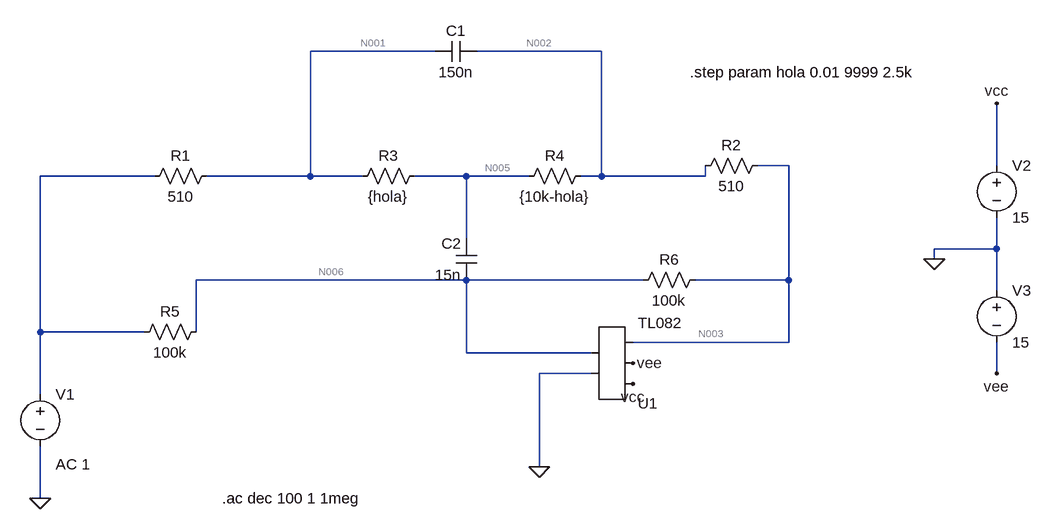
[diagram p0: schematic Spice.asc]
* Spice.asc
R1 N001 N004 510
R2 N003 N002 510
R3 N005 N001 {hola}
R4 N002 N005 {10k-hola}
R5 N006 N004 100k
R6 N003 N006 100k
C1 N002 N001 150n
C2 N006 N005 15n
V1 N004 0 AC 1
V2 vcc 0 15
V3 0 vee 15
* U1: TL082 (symbol AutoGenerated\TL082 not available, pins judged from their places): pin1=0 pin2=N006 pin3=vcc pin4=vee pin5=N003
.ac dec 100 1 1meg
.step param hola 0.01 9999 2.5k
.backanno
.end

* Results of the author's LTspice run, read from the files saved beside the schematic
* Operating Point (first step), zero values left out:
*   hola = 10 m
*   V(n001) = 1.224 µV
*   V(n003) = 26.45 µV
*   V(n002) = 25.22 µV
*   V(n005) = 1.224 µV
*   V(n006) = 10.97 µV
*   V(vcc) = 15 V
*   V(vee) = -15 V
*   I(R6) = 154.8 pA
*   I(R5) = 109.7 pA
*   I(R4) = 2.4 nA
*   I(R3) = 2.4 nA
*   I(R2) = 2.4 nA
*   I(R1) = 2.4 nA
*   I(V3) = -14.19 mA
*   I(V2) = -14.19 mA
*   I(V1) = 2.51 nA
*   Ix(u1:1) = 45.05 pA
*   Ix(u1:2) = 45.05 pA
*   Ix(u1:3) = 14.19 mA
*   Ix(u1:4) = -14.19 mA
*   Ix(u1:5) = -2.555 nA
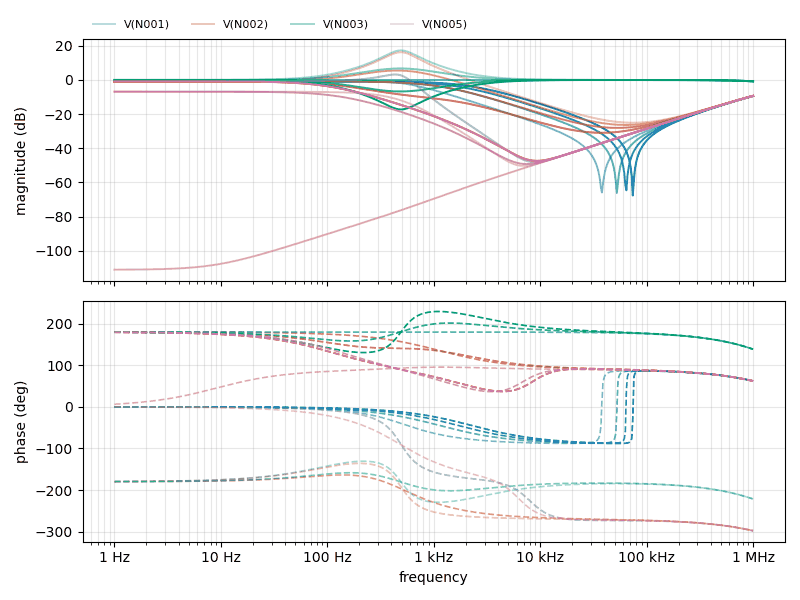
[diagram p1: AC Analysis of Spice.asc, plotted from the saved traces]
* AC Analysis, 5 runs:
*   V(N001) [hola=0.01]: -0.84 dB at 1 Hz, -9.36 dB at 1 MHz, peak 3.19 dB at 436.5 Hz, 3 dB below the peak at 190 Hz and 583 Hz
*   V(N001) [hola=2500.01]: -0.84 dB at 1 Hz, -9.37 dB at 1 MHz, peak -0.71 dB at 204.2 Hz, 3 dB below the peak at 721.6 Hz
*   V(N001) [hola=5000.01]: -0.84 dB at 1 Hz, -9.38 dB at 1 MHz, peak -0.84 dB at 1 Hz, 3 dB below the peak at 1.145 kHz
*   V(N001) [hola=7500.01]: -0.84 dB at 1 Hz, -9.39 dB at 1 MHz, peak -0.84 dB at 1 Hz, 3 dB below the peak at 1.682 kHz
*   V(N001) [hola=9999]: -0.84 dB at 1 Hz, -9.40 dB at 1 MHz, peak -0.84 dB at 1 Hz, 3 dB below the peak at 2.29 kHz
*   V(N002) [hola=0.01]: -0.84 dB at 1 Hz, -9.31 dB at 1 MHz, peak 16.25 dB at 489.8 Hz, 3 dB below the peak at 349.9 Hz and 677.6 Hz
*   V(N002) [hola=2500.01]: -0.84 dB at 1 Hz, -9.32 dB at 1 MHz, peak 5.51 dB at 457.1 Hz, 3 dB below the peak at 166.8 Hz and 1.025 kHz
*   V(N002) [hola=5000.01]: -0.84 dB at 1 Hz, -9.33 dB at 1 MHz, peak -0.84 dB at 1 Hz, 3 dB below the peak at 1.148 kHz
*   V(N002) [hola=7500.01]: -0.84 dB at 1 Hz, -9.34 dB at 1 MHz, peak -0.84 dB at 1 Hz, 3 dB below the peak at 154.7 Hz
*   V(N002) [hola=9999]: -0.84 dB at 1 Hz, -9.35 dB at 1 MHz, peak -0.84 dB at 1 Hz, 3 dB below the peak at 105.4 Hz
*   V(N003) [hola=0.01]: 0.00 dB at 1 Hz, -0.82 dB at 1 MHz, peak 17.28 dB at 489.8 Hz, 3 dB below the peak at 352.4 Hz and 686.3 Hz
*   V(N003) [hola=2500.01]: 0.00 dB at 1 Hz, -0.81 dB at 1 MHz, peak 6.73 dB at 478.6 Hz, 3 dB below the peak at 179.1 Hz and 1.302 kHz
*   V(N003) [hola=5000.01]: -0.00 dB at 1 Hz, -0.81 dB at 1 MHz, peak 0.00 dB at 6.761 kHz
*   V(N003) [hola=7500.01]: -0.00 dB at 1 Hz, -0.81 dB at 1 MHz, peak -0.00 dB at 1 Hz, 3 dB below the peak at 150.2 Hz
*   V(N003) [hola=9999]: -0.00 dB at 1 Hz, -0.81 dB at 1 MHz, peak -0.00 dB at 1 Hz, 3 dB below the peak at 98.75 Hz
*   V(N005) [hola=0.01]: -0.84 dB at 1 Hz, -9.36 dB at 1 MHz, peak 3.19 dB at 436.5 Hz, 3 dB below the peak at 190 Hz and 583 Hz
*   V(N005) [hola=2500.01]: -6.86 dB at 1 Hz, -9.36 dB at 1 MHz, peak -6.86 dB at 1 Hz, 3 dB below the peak at 369.9 Hz
*   V(N005) [hola=5000.01]: -111.02 dB at 1 Hz, -9.35 dB at 1 MHz, peak -9.35 dB at 1 MHz, 3 dB below the peak at 671 kHz
*   V(N005) [hola=7500.01]: -6.86 dB at 1 Hz, -9.35 dB at 1 MHz, peak -6.86 dB at 1 Hz, 3 dB below the peak at 135.3 Hz
*   V(N005) [hola=9999]: -0.85 dB at 1 Hz, -9.35 dB at 1 MHz, peak -0.85 dB at 1 Hz, 3 dB below the peak at 105.4 Hz